# EAGLE design PluggyReloadedEvery (EAGLE 9.6.2)
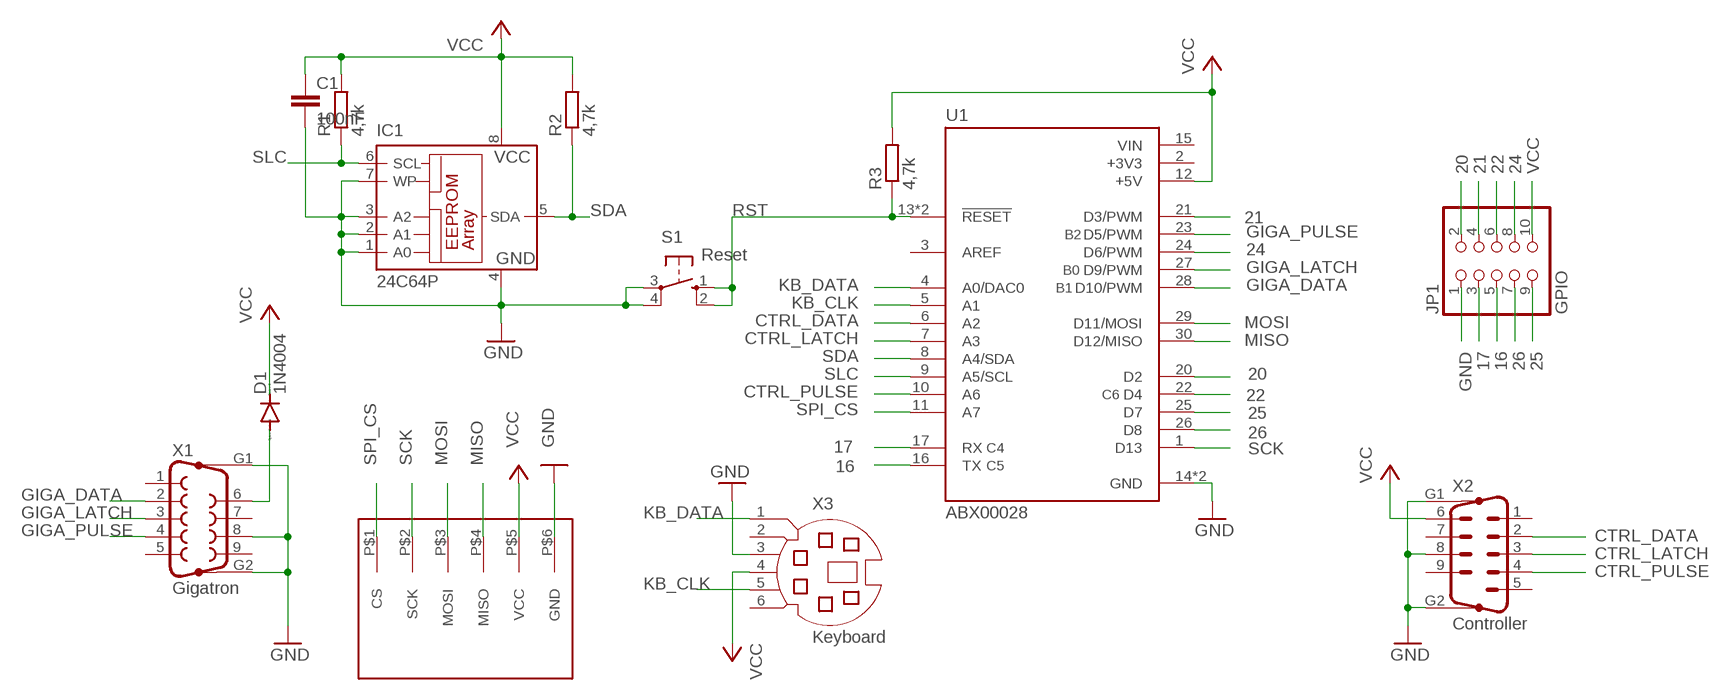
[diagram p0: schematic, sheet 1]

## Parts
C1  100nF  C-EU050-024X044  [C050-024X044]
D1  1N4004  [DO41-10]
IC1  24C64P  [DIL8]
JP1  GPIO  PINHD-2X5  [2X05]
R1  4,7k  R-EU_0207/10  [0207/10]
R2  4,7k  R-EU_0207/10  [0207/10]
R3  4,7k  R-EU_0207/10  [0207/10]
S1  Reset  10-XX  [B3F-10XX]
U1  ABX00028  [MODULE_ABX00028]
U$1  BREAKOUT_SD  [BREAKOUT_SD]
X1  Gigatron  F09HP  [F09HP]
X2  Controller  M09HP  [M09HP]
X3  Keyboard  MD06SS  [MDIN06SS]

## Nets
16: JP1.5 U1.16(TX)
17: JP1.3 U1.17(RX)
20: JP1.2 U1.20(D2)
21: JP1.4 U1.21(D3/PWM)
22: JP1.6 U1.22(D4)
24: JP1.8 U1.24(D6/PWM)
25: JP1.9 U1.25(D7)
26: JP1.7 U1.26(D8)
CTRL_DATA: U1.6(A2) X2.2
CTRL_LATCH: U1.7(A3) X2.3
CTRL_PULSE: U1.10(A6) X2.4
GIGA_DATA: U1.28(D10/PWM) X1.2
GIGA_LATCH: U1.27(D9/PWM) X1.3
GIGA_PULSE: U1.23(D5/PWM) X1.4
GND: C1.2 IC1.1(A0) IC1.2(A1) IC1.3(A2) IC1.4(GND) IC1.7(WP) JP1.1 S1.3(P) S1.4(P1) U1.14(GND) U1.19(GND) U$1.P$6(GND) X1.8 X1.G1 X1.G2 X2.8 X2.G1 X2.G2 X3.3
KB_CLK: U1.5(A1) X3.5
KB_DATA: U1.4(A0/DAC0) X3.1
MISO: U1.30(D12/MISO) U$1.P$4(MISO)
MOSI: U1.29(D11/MOSI) U$1.P$3(MOSI)
N$1: D1.A X1.6
RST: R3.1 S1.1(S) S1.2(S1) U1.13(!RESET) U1.18(!RESET)
SCK: U1.1(D13) U$1.P$2(SCK)
SDA: IC1.5(SDA) R2.1 U1.8(A4/SDA)
SLC: IC1.6(SCL) R1.1 U1.9(A5/SCL)
SPI_CS: U1.11(A7) U$1.P$1(CS)
VCC: C1.1 D1.C IC1.8(VCC) JP1.10 R1.2 R2.2 R3.2 U1.12(+5V) U$1.P$5(VCC) X2.6 X3.4
Unconnected: U1.3(AREF) X1.1 X1.5 X1.7 X1.9 X2.1 X2.5 X2.7 X2.9 X3.2 X3.6

## Notes on the sheet
- B2
- B0
- B1
- C6
- C4
- C5

## Power pins joined to a net without a drawn wire
+3V3: U1.2(+3V3)
VIN: U1.15(VIN)

## Library data of the parts
C1 = rcl:C-EU: CAPACITOR, European symbol; SPICEPREFIX: C
D1 = diode:1N4004: DIODE general purpose rectifier, 1 A
IC1 = microchip:24*: Serial EEPROM I2C; MF: RAMTRON INTERNATIONAL CORP; MPN: FM24C64-P; OC_FARNELL: 1362657; OC_NEWARK: 97H6452
JP1 = pinhead:PINHD-2X5: PIN HEADER
R1-R3 = rcl:R-EU_: RESISTOR, European symbol; SPICEPREFIX: R
S1 = switch-omron:10-XX: OMRON SWITCH; MPN: B3F-1000; OC_FARNELL: 176432; OC_NEWARK: 36M3542
U1 = ABX00028:ABX00028: ATmega4809 Arduino Nano Every AVR AVR MCU 8-Bit Embedded Evaluation Board Check availability <https://pricing.snapeda.com/parts/Arduino%20Nano%20Every/Arduino/view-part?ref=eda>; AVAILABILITY: In Stock; DESCRIPTION: Arduino’s 5V compatible board in the smallest available form factor: 45x18mm!; MF: Arduino; MP: Arduino Nano Every; PACKAGE: None; PRICE: None; PURCHASE-URL: https://pricing.snapeda.com/search/part/Arduino Nano Every/?ref=eda
U$1 = Breakout Micro SD:BREAKOUT_SD
X1 = con-subd:F09HP: SUB-D; OC_FARNELL: unknown; OC_NEWARK: unknown
X2 = con-subd:M09HP: SUB-D; OC_FARNELL: unknown; OC_NEWARK: unknown
X3 = con-yamaichi:MD06SS: YAMAICHI CONNECTOR; OC_FARNELL: unknown; OC_NEWARK: unknown

## Board
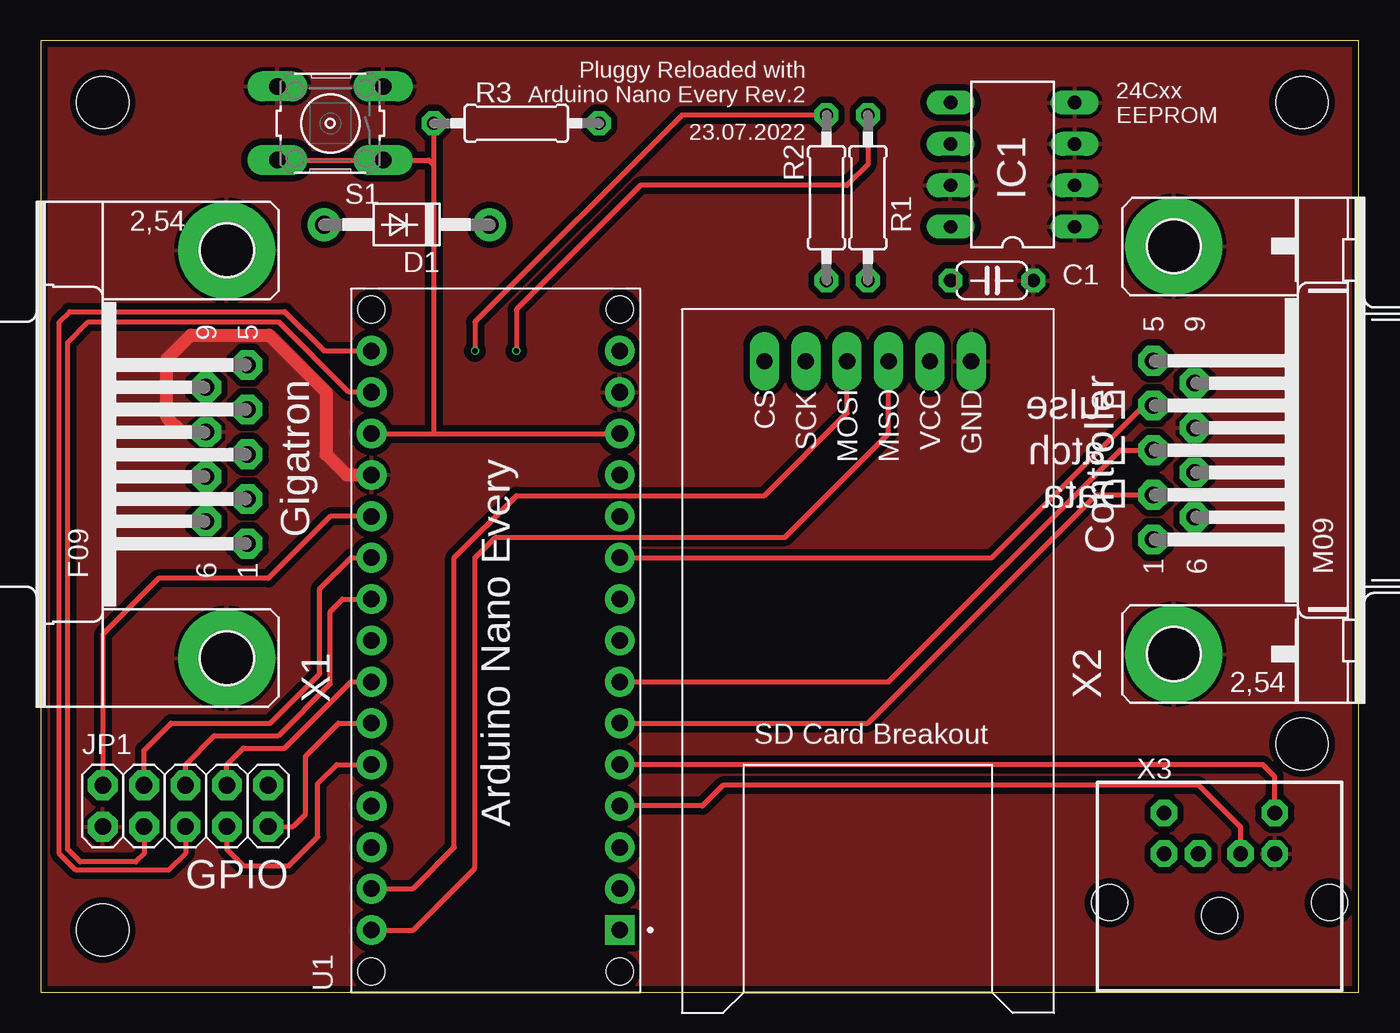
[diagram p1: board, top side]
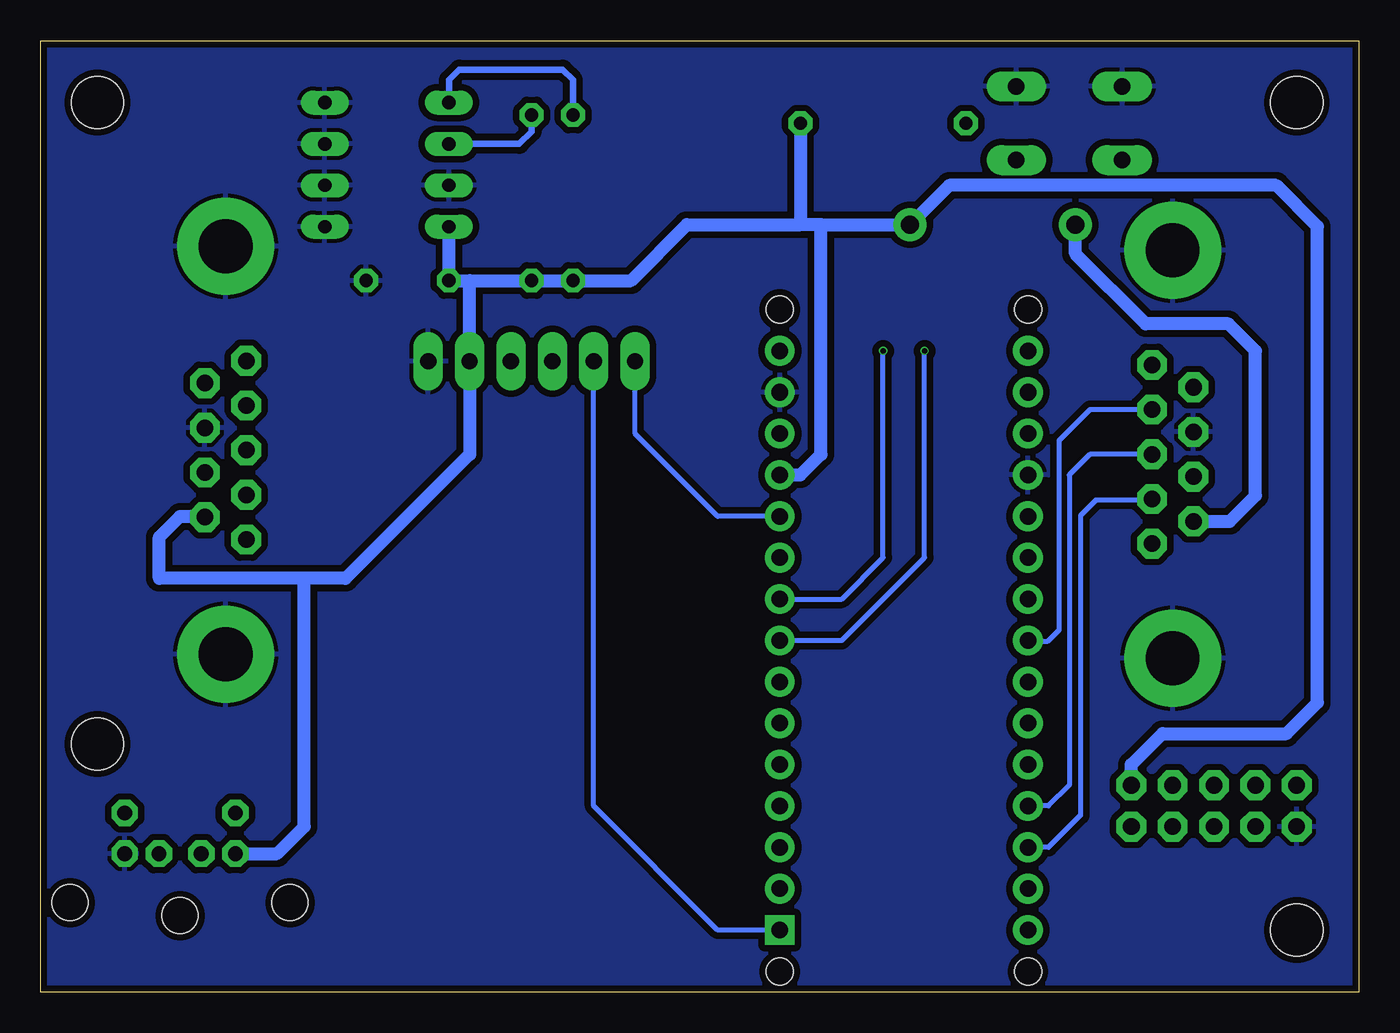
[diagram p2: board, bottom side, seen from below]

Size 80.95 x 58.41 mm. Coordinates in mm from the lower left corner, seen from the top.
Outline: 0,0 80.95,0 80.95,58.41 0,58.41 0,0
Copper layers (1*16): Top 0.035mm / dielectric 1.6mm / Bottom 0.035mm
Design rules "jlcpcb-2layers": minimum track width 5mil, minimum drill 0.3mm, track to track 5mil, track to pad 5mil, pad to pad 5mil, via to via 5mil, smd to smd 5mil, copper to edge 0.2mm, drill to drill 6mil, minimum pad ring 10mil, minimum via ring 3mil, stop-mask expansion 4mil, vias tented up to drill 0mil, thermal gap 10mil
Holes 0.35 mm at -5.08,60.96
Holes 3.2 mm at 3.81,54.61 3.81,3.81 77.47,54.61 77.47,15.24

### Footprints (pad centres in the part's own frame; a part is rotated, then mirrored left to right if it is on the bottom)
C050-024X044 = drill 0.813 octagon: 1 -2.54,0; 2 2.54,0
DO41-10 = drill 1.118: A 5.08,0; C -5.08,0
DIL8 = drill 0.813 long: 1 -3.81,-3.81; 2 -1.27,-3.81; 3 1.27,-3.81; 4 3.81,-3.81; 5 3.81,3.81; 6 1.27,3.81; 7 -1.27,3.81; 8 -3.81,3.81
2X05 = drill 1.016 octagon: 1 -5.08,-1.27; 2 -5.08,1.27; 3 -2.54,-1.27; 4 -2.54,1.27; 5 0,-1.27; 6 0,1.27; 7 2.54,-1.27; 8 2.54,1.27; 9 5.08,-1.27; 10 5.08,1.27
0207/10 = drill 0.813 octagon: 1 -5.08,0; 2 5.08,0
B3F-10XX = drill 1.016 long: 1 -3.251,2.261; 2 3.251,2.261; 3 -3.251,-2.261; 4 3.251,-2.261
MODULE_ABX00028 = drill 1.016 square: 1 -17.78,-7.62 | drill 1.016: 2 -15.24,-7.62; 3 -12.7,-7.62; 4 -10.16,-7.62; 5 -7.62,-7.62; 6 -5.08,-7.62; 7 -2.54,-7.62; 8 0,-7.62; 9 2.54,-7.62; 10 5.08,-7.62; 11 7.62,-7.62; 12 10.16,-7.62; 13 12.7,-7.62; 14 15.24,-7.62; 15 17.78,-7.62; 16 17.78,7.62; 17 15.24,7.62; 18 12.7,7.62; 19 10.16,7.62; 20 7.62,7.62; 21 5.08,7.62; 22 2.54,7.62; 23 0,7.62; 24 -2.54,7.62; 25 -5.08,7.62; 26 -7.62,7.62; 27 -10.16,7.62; 28 -12.7,7.62; 29 -15.24,7.62; 30 -17.78,7.62 | hole 1.651: -20.32,-7.62; -20.32,7.62; 20.32,7.62; 20.32,-7.62
BREAKOUT_SD = drill 1 long: P$1 5.08,40.005; P$2 7.62,40.005; P$3 10.16,40.005; P$4 12.7,40.005; P$5 15.24,40.005; P$6 17.78,40.005
F09HP = drill 1.016 octagon: 1 -5.486,-1.27; 2 -2.743,-1.27; 3 0,-1.27; 4 2.743,-1.27; 5 5.486,-1.27; 6 -4.115,1.27; 7 -1.372,1.27; 8 1.372,1.27; 9 4.115,1.27 | drill 3.302 pad 5.08: G1 -12.522,0; G2 12.522,0
M09HP = drill 1.016 octagon: 1 -5.486,1.27; 2 -2.743,1.27; 3 0,1.27; 4 2.743,1.27; 5 5.486,1.27; 6 -4.115,-1.27; 7 -1.372,-1.27; 8 1.372,-1.27; 9 4.115,-1.27 | drill 3.302 pad 5.08: G1 -12.522,0; G2 12.522,0
MDIN06SS = drill 0.9 octagon: 1 1.3,8.5; 2 -1.3,8.5; 3 3.4,8.5; 4 -3.4,8.5; 5 3.4,11; 6 -3.4,11 | hole 2.2: -6.75,5.5; 0,4.7; 6.75,5.5

### Placement (x,y rotation side)
C1  58.42,43.69 0 top
D1  22.48,47.12 180 top
IC1  59.69,50.8 90 top
JP1  8.89,11.43 0 top
R1  50.8,48.77 270 top
R2  48.26,48.77 270 top
R3  29.21,53.34 0 top
S1  17.78,53.34 180 top
U1  27.94,21.59 90 top
U$1  39.37,-1.27 0 top
X1  11.43,33.02 90 top
X2  69.6,33.27 90 top
X3  72.39,0 0 top

### Tracks (layer width: path | path; a pad name or v marks a point on that pad's centre or on a via)
16
  Top 0.305: JP1.5 8.89,8.51 7.87,7.49 2.16,7.49 1.14,8.51 1.14,41.15 1.78,41.78 14.99,41.78 17.4,39.37 U1.16
17
  Top 0.305: JP1.3 6.35,8.51 5.84,8 2.41,8 1.65,8.76 1.65,39.88 2.92,41.15 14.61,41.15 18.92,36.83 U1.17
20
  Top 0.305: JP1.2 3.81,21.97 7.24,25.4 13.97,25.4 17.78,29.21 U1.20
21
  Top 0.305: JP1.4 6.35,14.86 8,16.51 14.1,16.51 17.14,19.56 17.14,24.77 19.05,26.67 U1.21
22
  Top 0.305: JP1.6 8.89,13.97 10.67,15.75 14.61,15.75 17.78,18.92 17.78,23.37 18.54,24.13 U1.22
24
  Top 0.305: JP1.8 11.43,13.97 12.45,14.99 14.99,14.99 19.05,19.05 U1.24
25
  Top 0.305: JP1.9 15.49,10.16 16.26,10.92 16.26,14.48 18.29,16.51 U1.25
26
  Top 0.305: JP1.7 11.43,8.76 12.45,7.75 15.24,7.75 17.02,9.53 17.02,12.83 18.16,13.97 U1.26
CTRL_DATA
  Top 0.305: U1.6 50.8,16.51 64.82,30.53 X2.2
CTRL_LATCH
  Top 0.305: U1.7 52.07,19.05 66.29,33.27 X2.3
CTRL_PULSE
  Top 0.305: U1.10 58.42,26.67 67.77,36.02 X2.4
GIGA_DATA
  Bottom 0.305: X1.2 12.75,30.23 16.13,30.23 17.09,29.26 17.09,10.85 19.05,8.89 U1.28
GIGA_LATCH
  Bottom 0.305: X1.3 16.51,33.02 17.78,31.75 17.78,12.7 19.05,11.43 U1.27
GIGA_PULSE
  Bottom 0.305: X1.4 16.51,35.76 18.41,33.86 18.41,22.23 19.13,21.51 20.24,21.51 U1.23
GND
  Top 0.813: X1.8 8.66,34.39 7.75,35.31 7.75,38.86 9.22,40.34 14.02,40.34 17.53,36.83 17.53,33.02 18.8,31.75 U1.19
  pour Bottom (isolate 0.406): 0,58.42 0,0 81.28,0 81.28,58.42
  pour Top (isolate 0.406): 0,58.42 0,0 81.28,0 81.28,58.42
KB_CLK
  Top 0.305: X3.5 75.79,13.24 75.06,13.97 U1.5
KB_DATA
  Top 0.305: X3.1 73.69,10.13 71.12,12.7 41.91,12.7 40.64,11.43 U1.4
MISO
  Top 0.305: U1.30 22.86,3.81 26.67,7.62 26.67,26.67 27.94,27.94 45.72,27.94 52.07,34.29 U$1.P$4
MOSI
  Top 0.305: U1.29 22.86,6.35 25.4,8.89 25.4,26.67 29.21,30.48 44.45,30.48 49.53,35.56 U$1.P$3
N$1
  Bottom 0.813: X1.6 7.92,28.91 6.35,30.48 6.35,39.37 8,41.02 13.08,41.02 17.4,45.34 D1.A
RST
  Top 0.305: U1.18 24.13,34.29 | 24.13,34.29 U1.13 | R3.1 24.13,50.8 | 24.13,50.8 24.13,34.29 | 24.13,50.8 23.85,51.08 S1.1 S1.2
SCK
  Bottom 0.305: U$1.P$2 46.99,11.43 39.37,3.81 U1.1
SDA  (via drill 0.35)
  Top 0.305: v26.67,39.37 26.67,41.15 39.37,53.85 R2.1
  Bottom 0.305: U1.8 31.75,21.59 26.67,26.67 v26.67,39.37
  Bottom 0.406: R2.1 48.26,56.01 48.9,56.64 55.24,56.64 55.88,56.01 IC1.5
SLC  (via drill 0.35)
  Top 0.305: R1.1 50.8,50.8 49.53,49.53 36.83,49.53 29.21,41.91 v29.21,39.37
  Bottom 0.305: U1.9 31.75,24.13 29.21,26.67 v29.21,39.37
  Bottom 0.406: R1.1 50.8,52.83 51.56,52.07 IC1.6
SPI_CS
  Bottom 0.305: U$1.P$1 44.45,34.29 39.37,29.21 U1.11
VCC
  Bottom 0.813: 54.61,43.69 C1.1 IC1.8 | 54.61,43.69 R1.2 R2.2 44.7,43.69 41.27,47.12 34.29,47.12 | 33.02,47.12 D1.C 25.15,49.53 5.08,49.53 2.54,46.99 2.54,17.78 4.45,15.88 12.06,15.88 13.97,13.97 JP1.10 | U1.12 34.29,31.75 33.02,33.02 33.02,47.12 | 54.61,43.69 U$1.P$5 54.61,33.02 62.23,25.4 64.77,25.4 | X2.6 70.92,29.21 72.39,29.21 73.66,27.94 73.66,25.4 64.77,25.4 | R3.2 34.29,47.12 | 33.02,47.12 34.29,47.12 | X3.4 66.43,8.5 64.77,10.16 64.77,25.4

### Text on the board
tPlace: Pluggy Reloaded with / Arduino Nano Every Rev.2 | 23.07.2022 | 24Cxx / EEPROM | Pulse | Latch | Data | Arduino Nano Every | GPIO